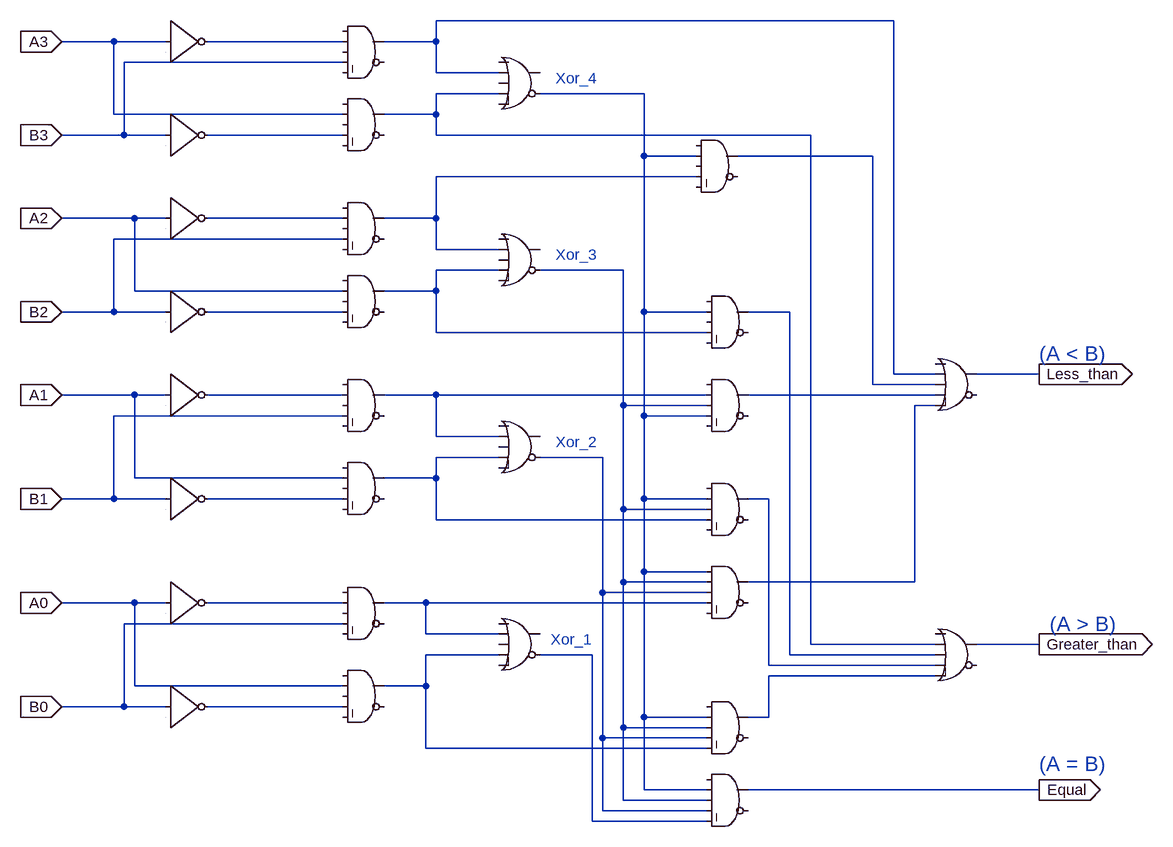
[diagram p0: schematic 4-bit_comparator.asc]
4-bit_comparator.asc, the LTspice schematic file:
Version 4
SHEET 1 2408 1296
WIRE 1152 16 448 16
WIRE -48 48 -128 48
WIRE 32 48 -48 48
WIRE 304 48 96 48
WIRE 448 48 448 16
WIRE 448 48 368 48
WIRE 304 80 -32 80
WIRE 448 96 448 48
WIRE 544 96 448 96
WIRE 544 128 448 128
WIRE 768 128 608 128
WIRE -48 160 -48 48
WIRE 304 160 -48 160
WIRE 448 160 448 128
WIRE 448 160 368 160
WIRE -32 192 -32 80
WIRE -32 192 -128 192
WIRE 32 192 -32 192
WIRE 304 192 96 192
WIRE 448 192 448 160
WIRE 1024 192 448 192
WIRE 768 224 768 128
WIRE 848 224 768 224
WIRE 1120 224 912 224
WIRE 848 256 448 256
WIRE -16 320 -128 320
WIRE 32 320 -16 320
WIRE 304 320 96 320
WIRE 448 320 448 256
WIRE 448 320 368 320
WIRE 304 352 -48 352
WIRE 448 368 448 320
WIRE 544 368 448 368
WIRE 544 400 448 400
WIRE 736 400 608 400
WIRE -16 432 -16 320
WIRE 304 432 -16 432
WIRE 448 432 448 400
WIRE 448 432 368 432
WIRE -48 464 -48 352
WIRE -48 464 -128 464
WIRE 32 464 -48 464
WIRE 304 464 96 464
WIRE 768 464 768 224
WIRE 864 464 768 464
WIRE 992 464 928 464
WIRE 448 496 448 432
WIRE 864 496 448 496
WIRE 1152 560 1152 16
WIRE 1216 560 1152 560
WIRE 1376 560 1280 560
WIRE 1120 576 1120 224
WIRE 1216 576 1120 576
WIRE -16 592 -128 592
WIRE 32 592 -16 592
WIRE 304 592 96 592
WIRE 448 592 368 592
WIRE 864 592 448 592
WIRE 1216 592 928 592
WIRE 736 608 736 400
WIRE 864 608 736 608
WIRE 1216 608 1184 608
WIRE 304 624 -48 624
WIRE 768 624 768 464
WIRE 864 624 768 624
WIRE 448 656 448 592
WIRE 544 656 448 656
WIRE 544 688 448 688
WIRE 704 688 608 688
WIRE -16 720 -16 592
WIRE 304 720 -16 720
WIRE 448 720 448 688
WIRE 448 720 368 720
WIRE -48 752 -48 624
WIRE -48 752 -128 752
WIRE 32 752 -48 752
WIRE 304 752 96 752
WIRE 768 752 768 624
WIRE 864 752 768 752
WIRE 960 752 928 752
WIRE 736 768 736 608
WIRE 864 768 736 768
WIRE 448 784 448 720
WIRE 864 784 448 784
WIRE 768 864 768 752
WIRE 864 864 768 864
WIRE 736 880 736 768
WIRE 864 880 736 880
WIRE 1184 880 1184 608
WIRE 1184 880 928 880
WIRE 704 896 704 688
WIRE 864 896 704 896
WIRE -16 912 -128 912
WIRE 32 912 -16 912
WIRE 304 912 96 912
WIRE 432 912 368 912
WIRE 864 912 432 912
WIRE 304 944 -32 944
WIRE 432 960 432 912
WIRE 544 960 432 960
WIRE 1024 976 1024 192
WIRE 1216 976 1024 976
WIRE 1376 976 1280 976
WIRE 544 992 432 992
WIRE 688 992 608 992
WIRE 992 992 992 464
WIRE 1216 992 992 992
WIRE 960 1008 960 752
WIRE 1216 1008 960 1008
WIRE 1216 1024 960 1024
WIRE -16 1040 -16 912
WIRE 304 1040 -16 1040
WIRE 432 1040 432 992
WIRE 432 1040 368 1040
WIRE -32 1072 -32 944
WIRE -32 1072 -128 1072
WIRE 32 1072 -32 1072
WIRE 304 1072 96 1072
WIRE 768 1088 768 864
WIRE 864 1088 768 1088
WIRE 960 1088 960 1024
WIRE 960 1088 928 1088
WIRE 736 1104 736 880
WIRE 864 1104 736 1104
WIRE 704 1120 704 896
WIRE 864 1120 704 1120
WIRE 432 1136 432 1040
WIRE 864 1136 432 1136
WIRE 768 1200 768 1088
WIRE 864 1200 768 1200
WIRE 1376 1200 928 1200
WIRE 736 1216 736 1104
WIRE 864 1216 736 1216
WIRE 704 1232 704 1120
WIRE 864 1232 704 1232
WIRE 688 1248 688 992
WIRE 864 1248 688 1248
FLAG -128 48 A3
IOPIN -128 48 In
FLAG -128 192 B3
IOPIN -128 192 In
FLAG -128 320 A2
IOPIN -128 320 In
FLAG -128 464 B2
IOPIN -128 464 In
FLAG -128 592 A1
IOPIN -128 592 In
FLAG -128 752 B1
IOPIN -128 752 In
FLAG -128 912 A0
IOPIN -128 912 In
FLAG -128 1072 B0
IOPIN -128 1072 In
FLAG 1376 560 Less_than
IOPIN 1376 560 Out
FLAG 1376 976 Greater_than
IOPIN 1376 976 Out
FLAG 1376 1200 Equal
IOPIN 1376 1200 Out
SYMBOL Digital\\inv 32 -16 R0
WINDOW 0 8 32 Invisible 2
SYMATTR InstName A1
SYMBOL Digital\\inv 32 128 R0
WINDOW 0 8 32 Invisible 2
SYMATTR InstName A2
SYMBOL Digital\\inv 32 256 R0
WINDOW 0 8 32 Invisible 2
SYMATTR InstName A3
SYMBOL Digital\\inv 32 400 R0
WINDOW 0 8 32 Invisible 2
SYMATTR InstName A4
SYMBOL Digital\\inv 32 528 R0
WINDOW 0 8 32 Invisible 2
SYMATTR InstName A5
SYMBOL Digital\\inv 32 688 R0
WINDOW 0 8 32 Invisible 2
SYMATTR InstName A6
SYMBOL Digital\\inv 32 848 R0
WINDOW 0 8 32 Invisible 2
SYMATTR InstName A7
SYMBOL Digital\\inv 32 1008 R0
WINDOW 0 8 32 Invisible 2
SYMATTR InstName A8
SYMBOL Digital\\and 336 0 R0
WINDOW 0 16 24 Invisible 2
SYMATTR InstName A9
SYMBOL Digital\\and 336 112 R0
WINDOW 0 16 24 Invisible 2
SYMATTR InstName A10
SYMBOL Digital\\and 336 272 R0
WINDOW 0 16 24 Invisible 2
SYMATTR InstName A11
SYMBOL Digital\\and 336 384 R0
WINDOW 0 16 24 Invisible 2
SYMATTR InstName A12
SYMBOL Digital\\and 336 544 R0
WINDOW 0 16 24 Invisible 2
SYMATTR InstName A13
SYMBOL Digital\\and 336 672 R0
WINDOW 0 16 24 Invisible 2
SYMATTR InstName A14
SYMBOL Digital\\and 336 864 R0
WINDOW 0 16 24 Invisible 2
SYMATTR InstName A15
SYMBOL Digital\\and 336 992 R0
WINDOW 0 16 24 Invisible 2
SYMATTR InstName A16
SYMBOL Digital\\or 576 48 R0
WINDOW 0 -8 8 Invisible 2
SYMATTR InstName A17
SYMBOL Digital\\or 576 320 R0
WINDOW 0 -8 8 Invisible 2
SYMATTR InstName A18
SYMBOL Digital\\or 576 608 R0
WINDOW 0 -8 8 Invisible 2
SYMATTR InstName A19
SYMBOL Digital\\or 576 912 R0
WINDOW 0 -8 8 Invisible 2
SYMATTR InstName A20
SYMBOL Digital\\and 880 176 R0
WINDOW 0 16 24 Invisible 2
SYMATTR InstName A21
SYMBOL Digital\\and 896 416 R0
WINDOW 0 16 24 Invisible 2
SYMATTR InstName A22
SYMBOL Digital\\and 896 544 R0
WINDOW 0 16 24 Invisible 2
SYMATTR InstName A23
SYMBOL Digital\\and 896 704 R0
WINDOW 0 16 24 Invisible 2
SYMATTR InstName A24
SYMBOL Digital\\and 896 832 R0
WINDOW 0 16 24 Invisible 2
SYMATTR InstName A25
SYMBOL Digital\\and 896 1040 R0
WINDOW 0 16 24 Invisible 2
SYMATTR InstName A26
SYMBOL Digital\\and 896 1152 R0
WINDOW 0 16 24 Invisible 2
SYMATTR InstName A27
SYMBOL Digital\\or 1248 512 R0
WINDOW 0 -8 8 Invisible 2
SYMATTR InstName A28
SYMBOL Digital\\or 1248 928 R0
WINDOW 0 -8 8 Invisible 2
SYMATTR InstName A29
TEXT 624 968 Left 2 ;Xor_1
TEXT 632 664 Left 2 ;Xor_2
TEXT 632 376 Left 2 ;Xor_3
TEXT 632 104 Left 2 ;Xor_4
TEXT 1376 528 Left 3 ;(A < B)
TEXT 1392 944 Left 3 ;(A > B)
TEXT 1376 1160 Left 3 ;(A = B)

The netlist it stands for:
* 4-bit_comparator.asc
A1 A3 0 0 0 0 N002 0 0 BUF
A2 B3 0 0 0 0 N005 0 0 BUF
A3 A2 0 0 0 0 N008 0 0 BUF
A4 B2 0 0 0 0 N011 0 0 BUF
A5 A1 0 0 0 0 N013 0 0 BUF
A6 B1 0 0 0 0 N019 0 0 BUF
A7 A0 0 0 0 0 N021 0 0 BUF
A8 B0 0 0 0 0 N026 0 0 BUF
A9 0 N002 0 B3 0 0 N001 0 AND
A10 0 A3 0 N005 0 0 N003 0 AND
A11 0 N008 0 B2 0 0 N007 0 AND
A12 0 A2 0 N011 0 0 N009 0 AND
A13 0 N013 0 B1 0 0 N014 0 AND
A14 0 A1 0 N019 0 0 N017 0 AND
A15 0 N021 0 B0 0 0 N022 0 AND
A16 0 A0 0 N026 0 0 N023 0 AND
A17 0 N001 0 N003 0 N004 0 0 OR
A18 0 N007 0 N009 0 N010 0 0 OR
A19 0 N014 0 N017 0 N018 0 0 OR
A20 0 N022 0 N023 0 N024 0 0 OR
A21 0 N004 0 N007 0 0 N006 0 AND
A22 0 N004 0 N009 0 0 N012 0 AND
A23 0 N014 N010 N004 0 0 N015 0 AND
A24 0 N004 N010 N017 0 0 N020 0 AND
A25 N004 N010 N018 N022 0 0 N016 0 AND
A26 0 N004 N010 N018 N023 0 N025 0 AND
A27 0 N004 N010 N018 N024 0 Equal 0 AND
A28 0 N001 N006 N015 N016 0 Less_than 0 OR
A29 0 N003 N012 N020 N025 0 Greater_than 0 OR
* Xor_1
* Xor_2
* Xor_3
* Xor_4
* (A < B)
* (A > B)
* (A = B)
.backanno
.end